# EAGLE design cartridge_adapter_ext (EAGLE 7.5.0)
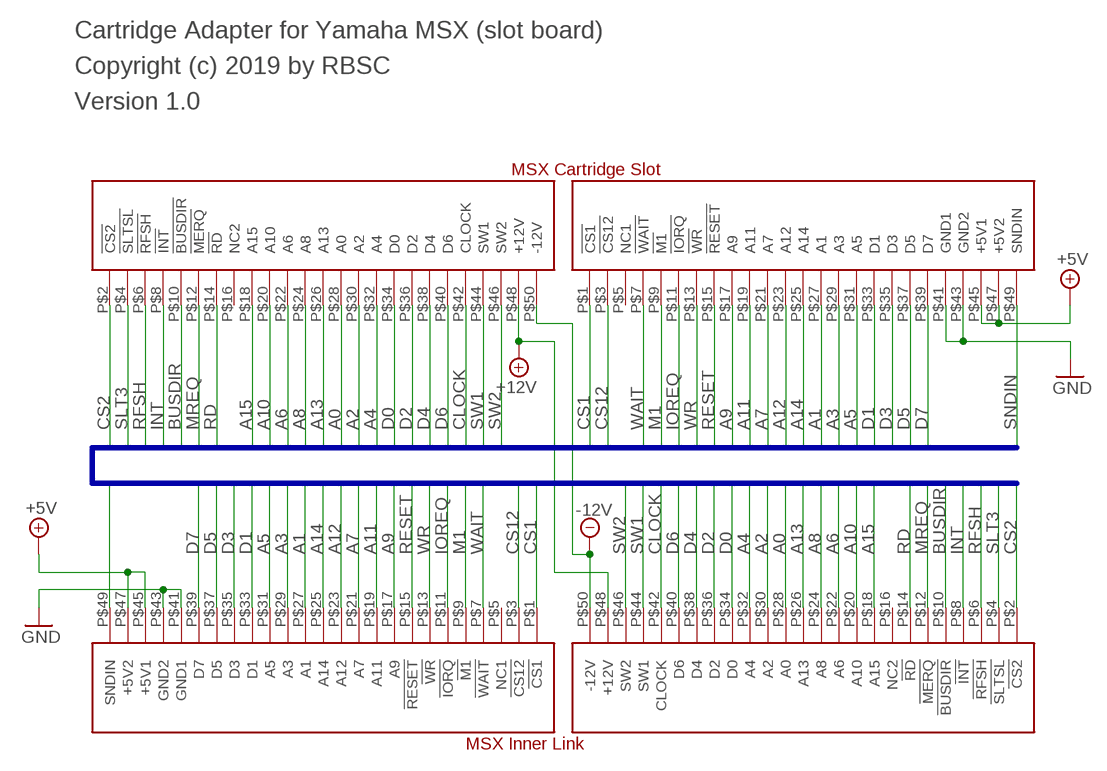
[diagram p0: schematic, sheet 1]

## Parts
CN1  MSX_SLOT  [MSX_SLOT]
CN2  MSX_INNER_LINK  [MSX_INNER_LINK]

## Nets
+5V: CN1.P$45(+5V1) CN1.P$47(+5V2) CN2.P$45(+5V1) CN2.P$47(+5V2)
+12V: CN1.P$48(+12V) CN2.P$48(+12V)
-12V: CN1.P$50(-12V) CN2.P$50(-12V)
A0: CN1.P$28(A0) CN2.P$28(A0)
A1: CN1.P$27(A1) CN2.P$27(A1)
A2: CN1.P$30(A2) CN2.P$30(A2)
A3: CN1.P$29(A3) CN2.P$29(A3)
A4: CN1.P$32(A4) CN2.P$32(A4)
A5: CN1.P$31(A5) CN2.P$31(A5)
A6: CN1.P$22(A6) CN2.P$22(A6)
A7: CN1.P$21(A7) CN2.P$21(A7)
A8: CN1.P$24(A8) CN2.P$24(A8)
A9: CN1.P$17(A9) CN2.P$17(A9)
A10: CN1.P$20(A10) CN2.P$20(A10)
A11: CN1.P$19(A11) CN2.P$19(A11)
A12: CN1.P$23(A12) CN2.P$23(A12)
A13: CN1.P$26(A13) CN2.P$26(A13)
A14: CN1.P$25(A14) CN2.P$25(A14)
A15: CN1.P$18(A15) CN2.P$18(A15)
BUSDIR: CN1.P$10(!BUSDIR) CN2.P$10(!BUSDIR)
CLOCK: CN1.P$42(CLOCK) CN2.P$42(CLOCK)
CS1: CN1.P$1(!CS1) CN2.P$1(!CS1)
CS2: CN1.P$2(!CS2) CN2.P$2(!CS2)
CS12: CN1.P$3(!CS12) CN2.P$3(!CS12)
D0: CN1.P$34(D0) CN2.P$34(D0)
D1: CN1.P$33(D1) CN2.P$33(D1)
D2: CN1.P$36(D2) CN2.P$36(D2)
D3: CN1.P$35(D3) CN2.P$35(D3)
D4: CN1.P$38(D4) CN2.P$38(D4)
D5: CN1.P$37(D5) CN2.P$37(D5)
D6: CN1.P$40(D6) CN2.P$40(D6)
D7: CN1.P$39(D7) CN2.P$39(D7)
GND: CN1.P$41(GND1) CN1.P$43(GND2) CN2.P$41(GND1) CN2.P$43(GND2)
INT: CN1.P$8(!INT) CN2.P$8(!INT)
IOREQ: CN1.P$11(!IORQ) CN2.P$11(!IORQ)
M1: CN1.P$9(!M1) CN2.P$9(!M1)
MREQ: CN1.P$12(!MERQ) CN2.P$12(!MERQ)
RD: CN1.P$14(!RD) CN2.P$14(!RD)
RESET: CN1.P$15(!RESET) CN2.P$15(!RESET)
RFSH: CN1.P$6(!RFSH) CN2.P$6(!RFSH)
SLT3: CN1.P$4(!SLTSL) CN2.P$4(!SLTSL)
SNDIN: CN1.P$49(SNDIN) CN2.P$49(SNDIN)
SW1: CN1.P$44(SW1) CN2.P$44(SW1)
SW2: CN1.P$46(SW2) CN2.P$46(SW2)
WAIT: CN1.P$7(!WAIT) CN2.P$7(!WAIT)
WR: CN1.P$13(!WR) CN2.P$13(!WR)
Unconnected: CN1.P$5(NC1) CN1.P$16(NC2) CN2.P$5(NC1) CN2.P$16(NC2)

## Buses
D0,D1,D2,D3,D4,D5,D6,D7,A0,A1,A2,A3,A4,A5,A6,A7,A8,A9,A10,A11,A12,A13,A14,A15,CS1,CS2,CS12,SLT3,RFSH,WAIT,INT,M1,BUSDIR,IOREQ,MREQ,WR,RD,RESET,GND,CLOCK,SW1,SW2,SNDIN

## Notes on the sheet
- Cartridge Adapter for Yamaha MSX (slot board)
- Copyright (c) 2019 by RBSC
- Version 1.0

## Library data of the parts
CN1 = msx_slot:MSX_SLOT
CN2 = msx_inner_link:MSX_INNER_LINK

## Board
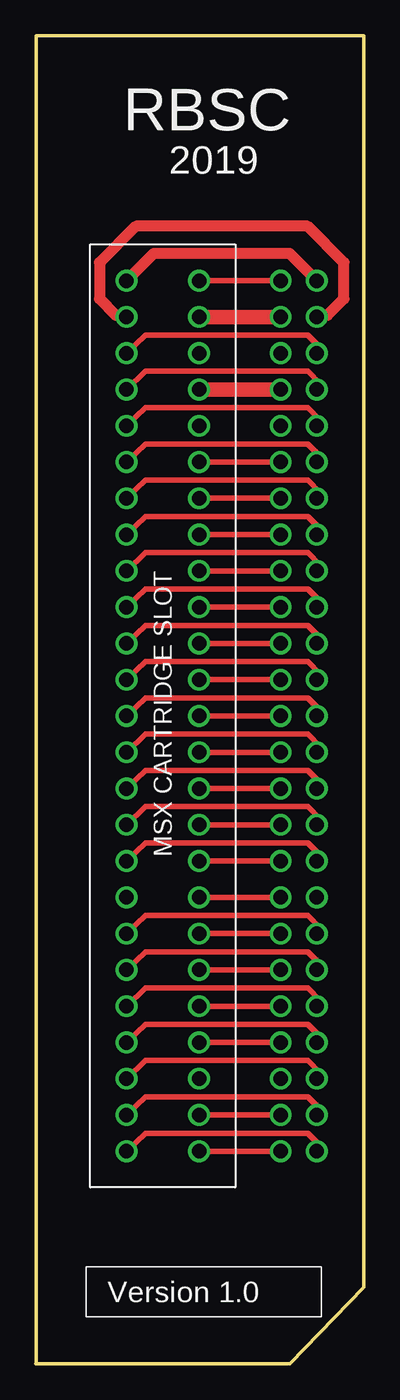
[diagram p1: board, top side]
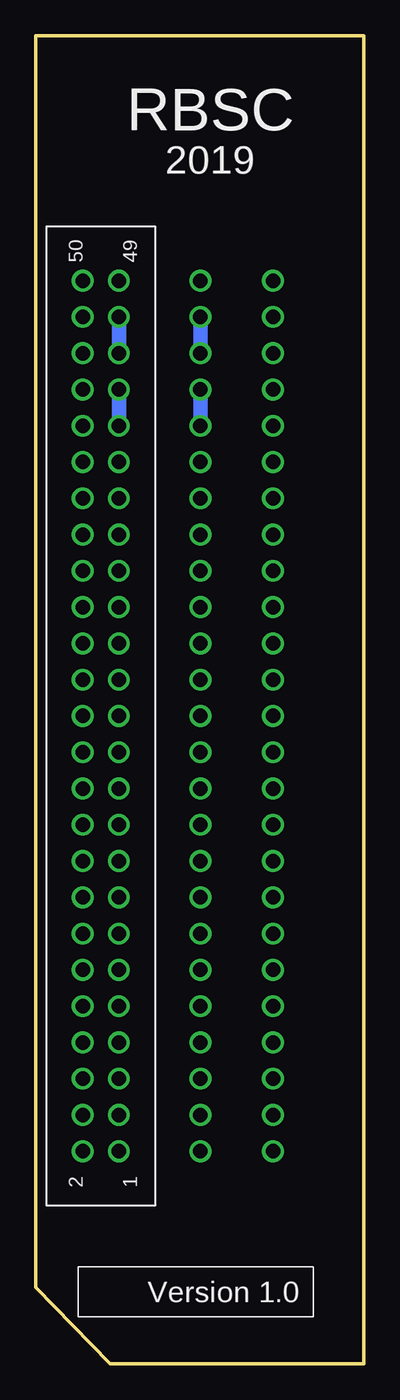
[diagram p2: board, bottom side, seen from below]

Size 23 x 93 mm. Coordinates in mm from the lower left corner, seen from the top.
Outline: 23,93 23,5.36 17.8,0 0.02,0
Outline: 0.02,0 0,0
Outline: 5.73,92.99 17.8,92.99
Outline: 0.02,32.66 0.02,51.72
Outline: 0.02,55.53 0.02,83.47
Outline: 22.88,92.99 0.02,92.99 0.02,0
Copper layers (1*16): Top 0.035mm / dielectric 1.5mm / Bottom 0.035mm
Design rules "default *": minimum track width 10mil, minimum drill 24mil, track to track 7mil, track to pad 8mil, pad to pad 8mil, via to via 8mil, smd to smd 8mil, copper to edge 4mil, drill to drill 8mil, minimum pad ring 10mil, minimum via ring 8mil, stop-mask expansion 4mil, vias tented up to drill 24mil, thermal gap 10mil

### Footprints (pad centres in the part's own frame; a part is rotated, then mirrored left to right if it is on the bottom)
MSX_SLOT = drill 1.016: P$1 63.5,7.62; P$2 63.5,2.54; P$3 60.96,7.62; P$4 60.96,2.54; P$5 58.42,7.62; P$6 58.42,2.54; P$7 55.88,7.62; P$8 55.88,2.54; P$9 53.34,7.62; P$10 53.34,2.54; P$11 50.8,7.62; P$12 50.8,2.54; P$13 48.26,7.62; P$14 48.26,2.54; P$15 45.72,7.62; P$16 45.72,2.54; P$17 43.18,7.62; P$18 43.18,2.54; P$19 40.64,7.62; P$20 40.64,2.54; P$21 38.1,7.62; P$22 38.1,2.54; P$23 35.56,7.62; P$24 35.56,2.54; P$25 33.02,7.62; P$26 33.02,2.54; P$27 30.48,7.62; P$28 30.48,2.54; P$29 27.94,7.62; P$30 27.94,2.54; P$31 25.4,7.62; P$32 25.4,2.54; P$33 22.86,7.62; P$34 22.86,2.54; P$35 20.32,7.62; P$36 20.32,2.54; P$37 17.78,7.62; P$38 17.78,2.54; P$39 15.24,7.62; P$40 15.24,2.54; P$41 12.7,7.62; P$42 12.7,2.54; P$43 10.16,7.62; P$44 10.16,2.54; P$45 7.62,7.62; P$46 7.62,2.54; P$47 5.08,7.62; P$48 5.08,2.54; P$49 2.54,7.62; P$50 2.54,2.54
MSX_INNER_LINK = drill 1.016: P$1 63.5,5.08; P$2 63.5,2.54; P$3 60.96,5.08; P$4 60.96,2.54; P$5 58.42,5.08; P$6 58.42,2.54; P$7 55.88,5.08; P$8 55.88,2.54; P$9 53.34,5.08; P$10 53.34,2.54; P$11 50.8,5.08; P$12 50.8,2.54; P$13 48.26,5.08; P$14 48.26,2.54; P$15 45.72,5.08; P$16 45.72,2.54; P$17 43.18,5.08; P$18 43.18,2.54; P$19 40.64,5.08; P$20 40.64,2.54; P$21 38.1,5.08; P$22 38.1,2.54; P$23 35.56,5.08; P$24 35.56,2.54; P$25 33.02,5.08; P$26 33.02,2.54; P$27 30.48,5.08; P$28 30.48,2.54; P$29 27.94,5.08; P$30 27.94,2.54; P$31 25.4,5.08; P$32 25.4,2.54; P$33 22.86,5.08; P$34 22.86,2.54; P$35 20.32,5.08; P$36 20.32,2.54; P$37 17.78,5.08; P$38 17.78,2.54; P$39 15.24,5.08; P$40 15.24,2.54; P$41 12.7,5.08; P$42 12.7,2.54; P$43 10.16,5.08; P$44 10.16,2.54; P$45 7.62,5.08; P$46 7.62,2.54; P$47 5.08,5.08; P$48 5.08,2.54; P$49 2.54,5.08; P$50 2.54,2.54

### Placement (x,y rotation side)
CN1  3.83,78.39 270 top
CN2  22.24,78.39 270 bottom

### Tracks (layer width: path | path; a pad name or v marks a point on that pad's centre or on a via)
+5V
  Top 1.016: CN2.P$47 CN1.P$47
  Bottom 1.016: CN1.P$47 CN1.P$45 | CN2.P$47 CN2.P$45
+12V
  Top 0.762: CN2.P$48 20.45,73.42 21.61,74.58 21.61,77.11 19.07,79.66 7.01,79.66 4.47,77.11 4.47,74.58 5.62,73.42 CN1.P$48
-12V
  Top 0.762: CN1.P$50 8.27,77.75 17.8,77.75 CN2.P$50
A0
  Top 0.4: CN2.P$28 19.96,48.28 19.07,49.17 7.7,49.17 CN1.P$28
A1
  Top 0.4: CN2.P$27 CN1.P$27
A2
  Top 0.4: CN2.P$30 19.96,50.83 19.07,51.72 7.7,51.72 CN1.P$30
A3
  Top 0.4: CN2.P$29 CN1.P$29
A4
  Top 0.4: CN2.P$32 19.96,53.36 19.07,54.25 7.7,54.25 CN1.P$32
A5
  Top 0.4: CN2.P$31 CN1.P$31
A6
  Top 0.4: CN2.P$22 19.96,40.66 19.07,41.55 7.7,41.55 CN1.P$22
A7
  Top 0.4: CN2.P$21 CN1.P$21
A8
  Top 0.4: CN2.P$24 19.96,43.2 19.07,44.09 7.7,44.09 CN1.P$24
A9
  Top 0.4: CN2.P$17 CN1.P$17
A10
  Top 0.4: CN2.P$20 19.96,38.12 19.07,39.02 7.7,39.02 CN1.P$20
A11
  Top 0.4: CN2.P$19 CN1.P$19
A12
  Top 0.4: CN2.P$23 CN1.P$23
A13
  Top 0.4: CN2.P$26 19.96,45.74 19.07,46.64 7.7,46.64 CN1.P$26
A14
  Top 0.4: CN2.P$25 CN1.P$25
A15
  Top 0.4: CN2.P$18 19.96,35.59 19.07,36.48 7.7,36.48 CN1.P$18
BUSDIR
  Top 0.4: CN2.P$10 19.96,25.42 19.07,26.31 7.7,26.31 CN1.P$10
CLOCK
  Top 0.4: CN2.P$42 19.96,66.06 19.07,66.95 7.7,66.95 CN1.P$42
CS1
  Top 0.4: CN2.P$1 CN1.P$1
CS2
  Top 0.4: CN2.P$2 19.96,15.27 19.07,16.16 7.7,16.16 CN1.P$2
CS12
  Top 0.4: CN2.P$3 CN1.P$3
D0
  Top 0.4: CN2.P$34 19.96,55.91 19.07,56.8 7.7,56.8 CN1.P$34
D1
  Top 0.4: CN2.P$33 CN1.P$33
D2
  Top 0.4: CN2.P$36 19.96,58.44 19.07,59.33 7.7,59.33 CN1.P$36
D3
  Top 0.4: CN2.P$35 CN1.P$35
D4
  Top 0.4: CN2.P$38 19.96,60.98 19.07,61.88 7.7,61.88 CN1.P$38
D5
  Top 0.4: CN2.P$37 CN1.P$37
D6
  Top 0.4: CN2.P$40 19.96,63.53 19.07,64.42 7.7,64.42 CN1.P$40
D7
  Top 0.4: CN2.P$39 CN1.P$39
GND
  Top 1.016: CN2.P$43 CN1.P$43
  Bottom 1.016: CN2.P$43 CN2.P$41 | CN1.P$43 CN1.P$41
INT
  Top 0.4: CN2.P$8 19.96,22.88 19.07,23.77 7.7,23.77 CN1.P$8
IOREQ
  Top 0.4: CN2.P$11 CN1.P$11
M1
  Top 0.4: CN2.P$9 CN1.P$9
MREQ
  Top 0.4: CN2.P$12 19.96,27.97 19.07,28.85 7.7,28.85 CN1.P$12
RD
  Top 0.4: CN2.P$14 19.96,30.51 19.07,31.4 7.7,31.4 CN1.P$14
RESET
  Top 0.4: CN2.P$15 CN1.P$15
RFSH
  Top 0.4: CN2.P$6 19.96,20.34 19.07,21.23 7.7,21.23 CN1.P$6
SLT3
  Top 0.4: CN2.P$4 19.96,17.8 19.07,18.7 7.7,18.7 CN1.P$4
SNDIN
  Top 0.4: CN2.P$49 CN1.P$49
SW1
  Top 0.4: CN2.P$44 19.96,68.61 19.07,69.5 7.7,69.5 CN1.P$44
SW2
  Top 0.4: CN2.P$46 19.96,71.14 19.07,72.03 7.7,72.03 CN1.P$46
WAIT
  Top 0.4: CN2.P$7 CN1.P$7
WR
  Top 0.4: CN2.P$13 CN1.P$13

### Text on the board
tNames: RBSC | 2019 | Version 1.0
bNames: RBSC | 2019 | Version 1.0